# EAGLE design stm32f4 disc (EAGLE 7.7.0)
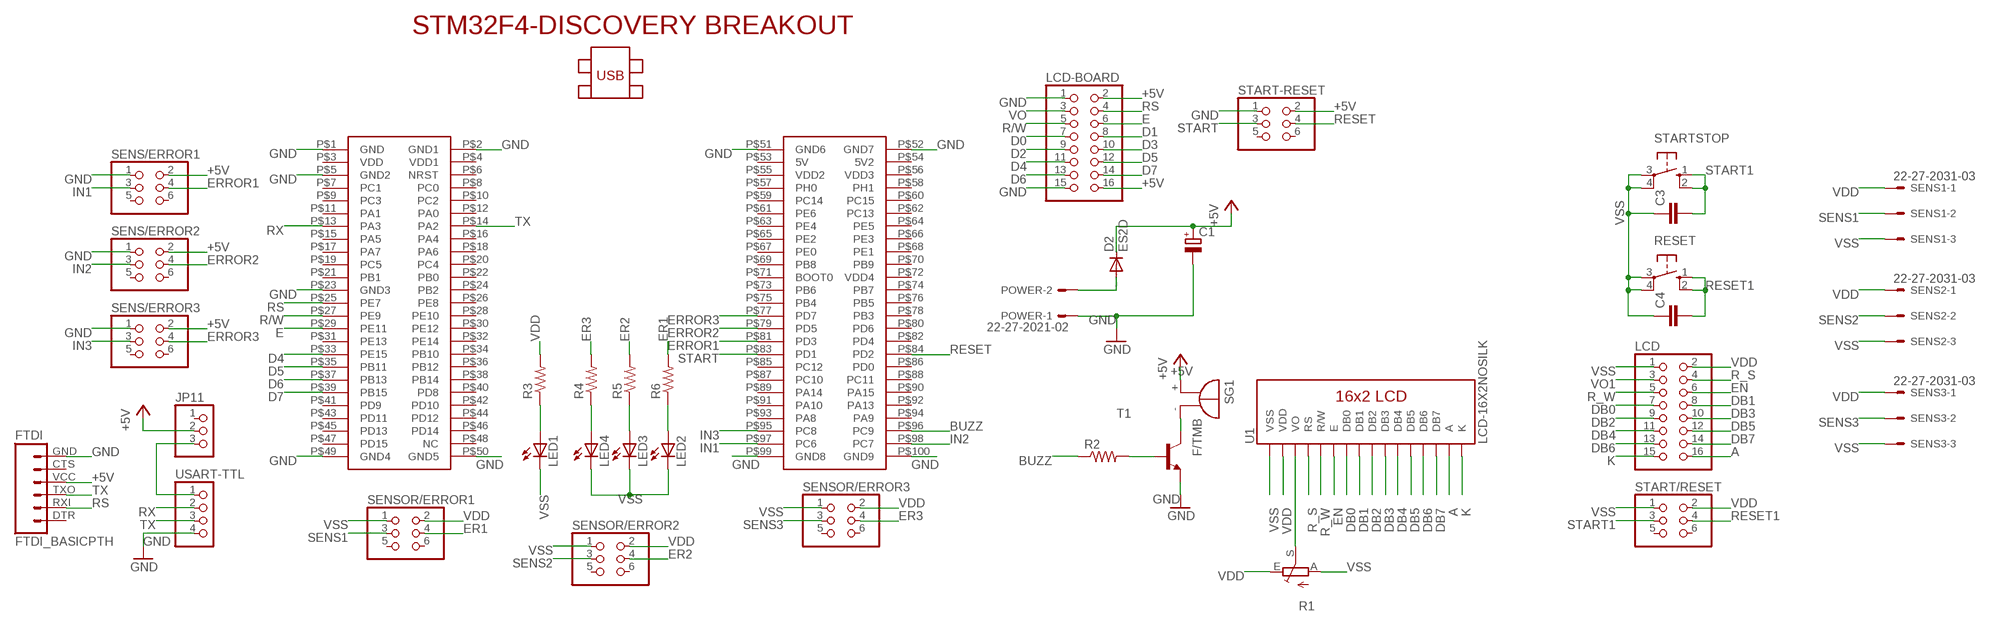
[diagram p0: schematic, sheet 1]

## Parts
C1  CPOL-EU140CLH-1010  [140CLH-1010]
C3  C-EUC0805  [C0805]
C4  C-EUC0805  [C0805]
D2  ES2D  [SMB]
FTDI  FTDI_BASICPTH  [FTDI_BASIC]
JP11  PINHD-1X3  [1X03]
LCD  PINHD-2X8  [2X08]
LCD-BOARD  PINHD-2X8  [2X08]
LED1  LED5MM  [LED5MM]
LED2  LED5MM  [LED5MM]
LED3  LED5MM  [LED5MM]
LED4  LED5MM  [LED5MM]
POWER  22-27-2021-02  [6410-02]
R1  TRIM_EU-CA6V  [CA6V]
R2  R-US_R0805  [R0805]
R3  R-US_R0805  [R0805]
R4  R-US_R0805  [R0805]
R5  R-US_R0805  [R0805]
R6  R-US_R0805  [R0805]
RESET  40-XX  [B3F-40XX]
SENS1  22-27-2031-03  [6410-03]
SENS2  22-27-2031-03  [6410-03]
SENS3  22-27-2031-03  [6410-03]
SENS/ERROR1  PINHD-2X3  [2X03]
SENS/ERROR2  PINHD-2X3  [2X03]
SENS/ERROR3  PINHD-2X3  [2X03]
SENSOR/ERROR1  PINHD-2X3  [2X03]
SENSOR/ERROR2  PINHD-2X3  [2X03]
SENSOR/ERROR3  PINHD-2X3  [2X03]
SG1  F/TMB  [F/TMB]
START-RESET  PINHD-2X3  [2X03]
START/RESET  PINHD-2X3  [2X03]
STARTSTOP  40-XX  [B3F-40XX]
T1  -NPN-SOT23-EBC  [SOT23-EBC]
U1  LCD-16X2NOSILK  [LCD-16X2_NOSILK]
U$1  STM32F4-DISCOVERY  [STM32F4-DISCOVERY]
USART-TTL  PINHD-1X4  [1X04]

## Nets
+5V: C1.+ D2.C FTDI.VCC JP11.2 LCD-BOARD.2 LCD-BOARD.16 SENS/ERROR1.2 SENS/ERROR2.2 SENS/ERROR3.2 SG1.+ START-RESET.2
A: LCD.16 U1.15(A)
BUZZ: R2.1 U$1.P$96(PC9)
D0: LCD-BOARD.7
D1: LCD-BOARD.8
D2: LCD-BOARD.9
D3: LCD-BOARD.10
D4: LCD-BOARD.11 U$1.P$33(PE15)
D5: LCD-BOARD.12 U$1.P$35(PB11)
D6: LCD-BOARD.13 U$1.P$37(PB13)
D7: LCD-BOARD.14 U$1.P$39(PB15)
DB0: LCD.7 U1.7(DB0)
DB1: LCD.8 U1.8(DB1)
DB2: LCD.9 U1.9(DB2)
DB3: LCD.10 U1.10(DB3)
DB4: LCD.11 U1.11(DB4)
DB5: LCD.12 U1.12(DB5)
DB6: LCD.13 U1.13(DB6)
DB7: LCD.14 U1.14(DB7)
E: LCD-BOARD.6 U$1.P$29(PE11)
EN: LCD.6 U1.6(E)
ER1: R6.2 SENSOR/ERROR1.4
ER2: R5.2 SENSOR/ERROR2.4
ER3: R4.2 SENSOR/ERROR3.4
ERROR1: SENS/ERROR1.4 U$1.P$81(PD3)
ERROR2: SENS/ERROR2.4 U$1.P$79(PD5)
ERROR3: SENS/ERROR3.4 U$1.P$77(PD7)
GND: C1.- FTDI.GND LCD-BOARD.1 LCD-BOARD.15 POWER.1 SENS/ERROR1.1 SENS/ERROR2.1 SENS/ERROR3.1 START-RESET.1 T1.E U$1.P$1(GND) U$1.P$2(GND1) U$1.P$5(GND2) U$1.P$23(GND3) U$1.P$49(GND4) U$1.P$50(GND5) U$1.P$51(GND6) U$1.P$52(GND7) U$1.P$99(GND8) U$1.P$100(GND9) USART-TTL.4
IN1: SENS/ERROR1.3 U$1.P$97(PC6)
IN2: SENS/ERROR2.3 U$1.P$98(PC7)
IN3: SENS/ERROR3.3 U$1.P$95(PC8)
K: LCD.15 U1.16(K)
N$1: SG1.- T1.C
N$2: R2.2 T1.B
N$7: LED2.A R6.1
N$8: LED3.A R5.1
N$9: JP11.3 USART-TTL.1
N$10: LED4.A R4.1
N$11: LED1.A R3.1
N$18: D2.A POWER.2
N$138: R1.S U1.3(VO)
R/W: LCD-BOARD.5 U$1.P$27(PE9)
R_S: LCD.4 U1.4(RS)
R_W: LCD.5 U1.5(R/W)
RESET: START-RESET.4 U$1.P$84(PD2)
RESET1: C4.2 RESET.1(S) RESET.2(S1) START/RESET.4
RS: FTDI.RXI LCD-BOARD.4 U$1.P$25(PE7)
RX: U$1.P$13(PA3) USART-TTL.2
SENS1: SENS1.2 SENSOR/ERROR1.3
SENS2: SENS2.2 SENSOR/ERROR2.3
SENS3: SENS3.2 SENSOR/ERROR3.3
START: START-RESET.3 U$1.P$83(PD1)
START1: C3.2 START/RESET.3 STARTSTOP.1(S) STARTSTOP.2(S1)
TX: FTDI.TXO U$1.P$14(PA2) USART-TTL.3
VDD: LCD.2 R1.E R3.2 SENS1.1 SENS2.1 SENS3.1 SENSOR/ERROR1.2 SENSOR/ERROR2.2 SENSOR/ERROR3.2 START/RESET.2 U1.2(VDD)
VO: LCD-BOARD.3
VO1: LCD.3
VSS: C3.1 C4.1 LCD.1 LED1.K(C) LED2.K(C) LED3.K(C) LED4.K(C) R1.A RESET.3(P) RESET.4(P1) SENS1.3 SENS2.3 SENS3.3 SENSOR/ERROR1.1 SENSOR/ERROR2.1 SENSOR/ERROR3.1 START/RESET.1 STARTSTOP.3(P) STARTSTOP.4(P1) U1.1(VSS)
Unconnected: FTDI.CTS FTDI.DTR JP11.1 SENS/ERROR1.5 SENS/ERROR1.6 SENS/ERROR2.5 SENS/ERROR2.6 SENS/ERROR3.5 SENS/ERROR3.6 SENSOR/ERROR1.5 SENSOR/ERROR1.6 SENSOR/ERROR2.5 SENSOR/ERROR2.6 SENSOR/ERROR3.5 SENSOR/ERROR3.6 START-RESET.5 START-RESET.6 START/RESET.5 START/RESET.6 U$1.P$3(VDD) U$1.P$4(VDD1) U$1.P$6(NRST) U$1.P$7(PC1) U$1.P$8(PC0) U$1.P$9(PC3) U$1.P$10(PC2) U$1.P$11(PA1) U$1.P$12(PA0) U$1.P$15(PA5) U$1.P$16(PA4) U$1.P$17(PA7) U$1.P$18(PA6) U$1.P$19(PC5) U$1.P$20(PC4) U$1.P$21(PB1) U$1.P$22(PB0) U$1.P$24(PB2) U$1.P$26(PE8) U$1.P$28(PE10) U$1.P$30(PE12) U$1.P$31(PE13) U$1.P$32(PE14) U$1.P$34(PB10) U$1.P$36(PB12) U$1.P$38(PB14) U$1.P$40(PD8) U$1.P$41(PD9) U$1.P$42(PD10) U$1.P$43(PD11) U$1.P$44(PD12) U$1.P$45(PD13) U$1.P$46(PD14) U$1.P$47(PD15) U$1.P$48(NC) U$1.P$53(5V) U$1.P$54(5V2) U$1.P$55(VDD2) U$1.P$56(VDD3) U$1.P$57(PH0) U$1.P$58(PH1) U$1.P$59(PC14) U$1.P$60(PC15) U$1.P$61(PE6) U$1.P$62(PC13) U$1.P$63(PE4) U$1.P$64(PE5) U$1.P$65(PE2) U$1.P$66(PE3) U$1.P$67(PE0) U$1.P$68(PE1) U$1.P$69(PB8) U$1.P$70(PB9) U$1.P$71(BOOT0) U$1.P$72(VDD4) U$1.P$73(PB6) U$1.P$74(PB7) U$1.P$75(PB4) U$1.P$76(PB5) U$1.P$78(PB3) U$1.P$80(PD6) U$1.P$82(PD4) U$1.P$85(PC12) U$1.P$86(PD0) U$1.P$87(PC10) U$1.P$88(PC11) U$1.P$89(PA14) U$1.P$90(PA15) U$1.P$91(PA10) U$1.P$92(PA13) U$1.P$93(PA8) U$1.P$94(PA9)

## Library data of the parts
C1 = rcl:CPOL-EU: POLARIZED CAPACITOR, European symbol
C3 C4 = rcl:C-EU: CAPACITOR, European symbol
D2 = diode:ES2D: DIODE super fast rectifier, 2 A
FTDI = SparkFun-Connectors:FTDI_BASIC: FTDI Basic header with labels
JP11 = pinhead:PINHD-1X3: PIN HEADER
LCD LCD-BOARD = pinhead:PINHD-2X8: PIN HEADER
LED1-LED4 = led:LED: LED OSRAM: - CHIPLED LG R971, LG N971, LY N971, LG Q971, LY Q971, LO R971, LY R971 LH N974, LH R974 LS Q976, LO Q976, LY Q976 LO Q996 - Hyper CHIPLED LW Q18S LB Q993, LB Q99A, LB R99A - SideLED LS A670, LO A670, LY A670, LG A670, LP A670 LB A673, LV A673, LT A673, LW A673 LH A674 LY A675 LS A676, LA A676, LO A676, LY A676, LW A676 LS A679, LY A679, LG A679 - Hyper Micro SIDELED® LS Y876, LA Y876, LO Y876, LY Y876 LT Y87S - SmartLED LW L88C, LW L88S LB L89C, LB L89S, LG L890 LS L89K, LO L89K, LY L89K LS L896, LA L896, LO L896, LY L896 - TOPLED LS T670, LO T670, LY T670, LG T670, LP T670 LSG T670, LSP T670, LSY T670, LOP T670, LYG T670 LG T671, LOG T671, LSG T671 LB T673, LV T673, LT T673, LW T673 LH T674 LS T676, LA T676, LO T676, LY T676, LB T676, LH T676, LSB T676, LW T676 LB T67C, LV T67C, LT T67C, LS T67K, LO T67K, LY T67K, LW E67C LS E67B, LA E67B, LO E67B, LY E67B, LB E67C, LV E67C, LT E67C LW T67C LS T679, LY T679, LG T679 LS T770, LO T770, LY T770, LG T770, LP T770 LB T773, LV T773, LT T773, LW T773 LH T774 LS E675, LA E675, LY E675, LS T675 LS T776, LA T776, LO T776, LY T776, LB T776 LHGB T686 LT T68C, LB T68C - Hyper Mini TOPLED® LB M676 - Mini TOPLED Santana® LG M470 LS M47K, LO M47K, LY M47K Source: http://www.osram.convergy.de LUXEON: - LUMILED® LXK2-PW12-R00, LXK2-PW12-S00, LXK2-PW14-U00, LXK2-PW14-V00 LXK2-PM12-R00, LXK2-PM12-S00, LXK2-PM14-U00 LXK2-PE12-Q00, LXK2-PE12-R00, LXK2-PE12-S00, LXK2-PE14-T00, LXK2-PE14-U00 LXK2-PB12-K00, LXK2-PB12-L00, LXK2-PB12-M00, LXK2-PB14-N00, LXK2-PB14-P00, LXK2-PB14-Q00 LXK2-PR12-L00, LXK2-PR12-M00, LXK2-PR14-Q00, LXK2-PR14-R00 LXK2-PD12-Q00, LXK2-PD12-R00, LXK2-PD12-S00 LXK2-PH12-R00, LXK2-PH12-S00 LXK2-PL12-P00, LXK2-PL12-Q00, LXK2-PL12-R00 Source: www.luxeon.com KINGBRIGHT: KA-3528ASYC Source: www.kingbright.com
POWER = con-molex:22-?-02: CONNECTOR wire to board 2.54 mm (.1 inch) pitch header; OC_FARNELL: unknown; OC_NEWARK: unknown
R1 = pot:TRIM_EU-: POTENTIOMETER
R2-R6 = rcl:R-US_: RESISTOR, American symbol
RESET STARTSTOP = switch-omron:40-XX: OMRON SWITCH; MF: OMRON COMPONENTS USA; MPN: B3F-4000; OC_FARNELL: 176434; OC_NEWARK: 36K3105
SENS1-SENS3 = con-molex:22-?-03: CONNECTOR wire to board 2.54 mm (.1 inch) pitch header; OC_FARNELL: unknown; OC_NEWARK: unknown
SENS/ERROR1-SENS/ERROR3 SENSOR/ERROR1-SENSOR/ERROR3 START-RESET START/RESET = pinhead:PINHD-2X3: PIN HEADER
SG1 = buzzer:F/TMB: BUZZER Source: Buerklin; OC_FARNELL: unknown; OC_NEWARK: unknown
T1 = transistor-neu-to92:*-NPN-: NPN Transistror
U1 = SparkFun-Displays:LCD-16X2: Standard text-only 16x2 parallel input LCD
U$1 = STM32F4-DISCOVERY 2:STM32F4-DISCOVERY
USART-TTL = pinhead:PINHD-1X4: PIN HEADER

## Board
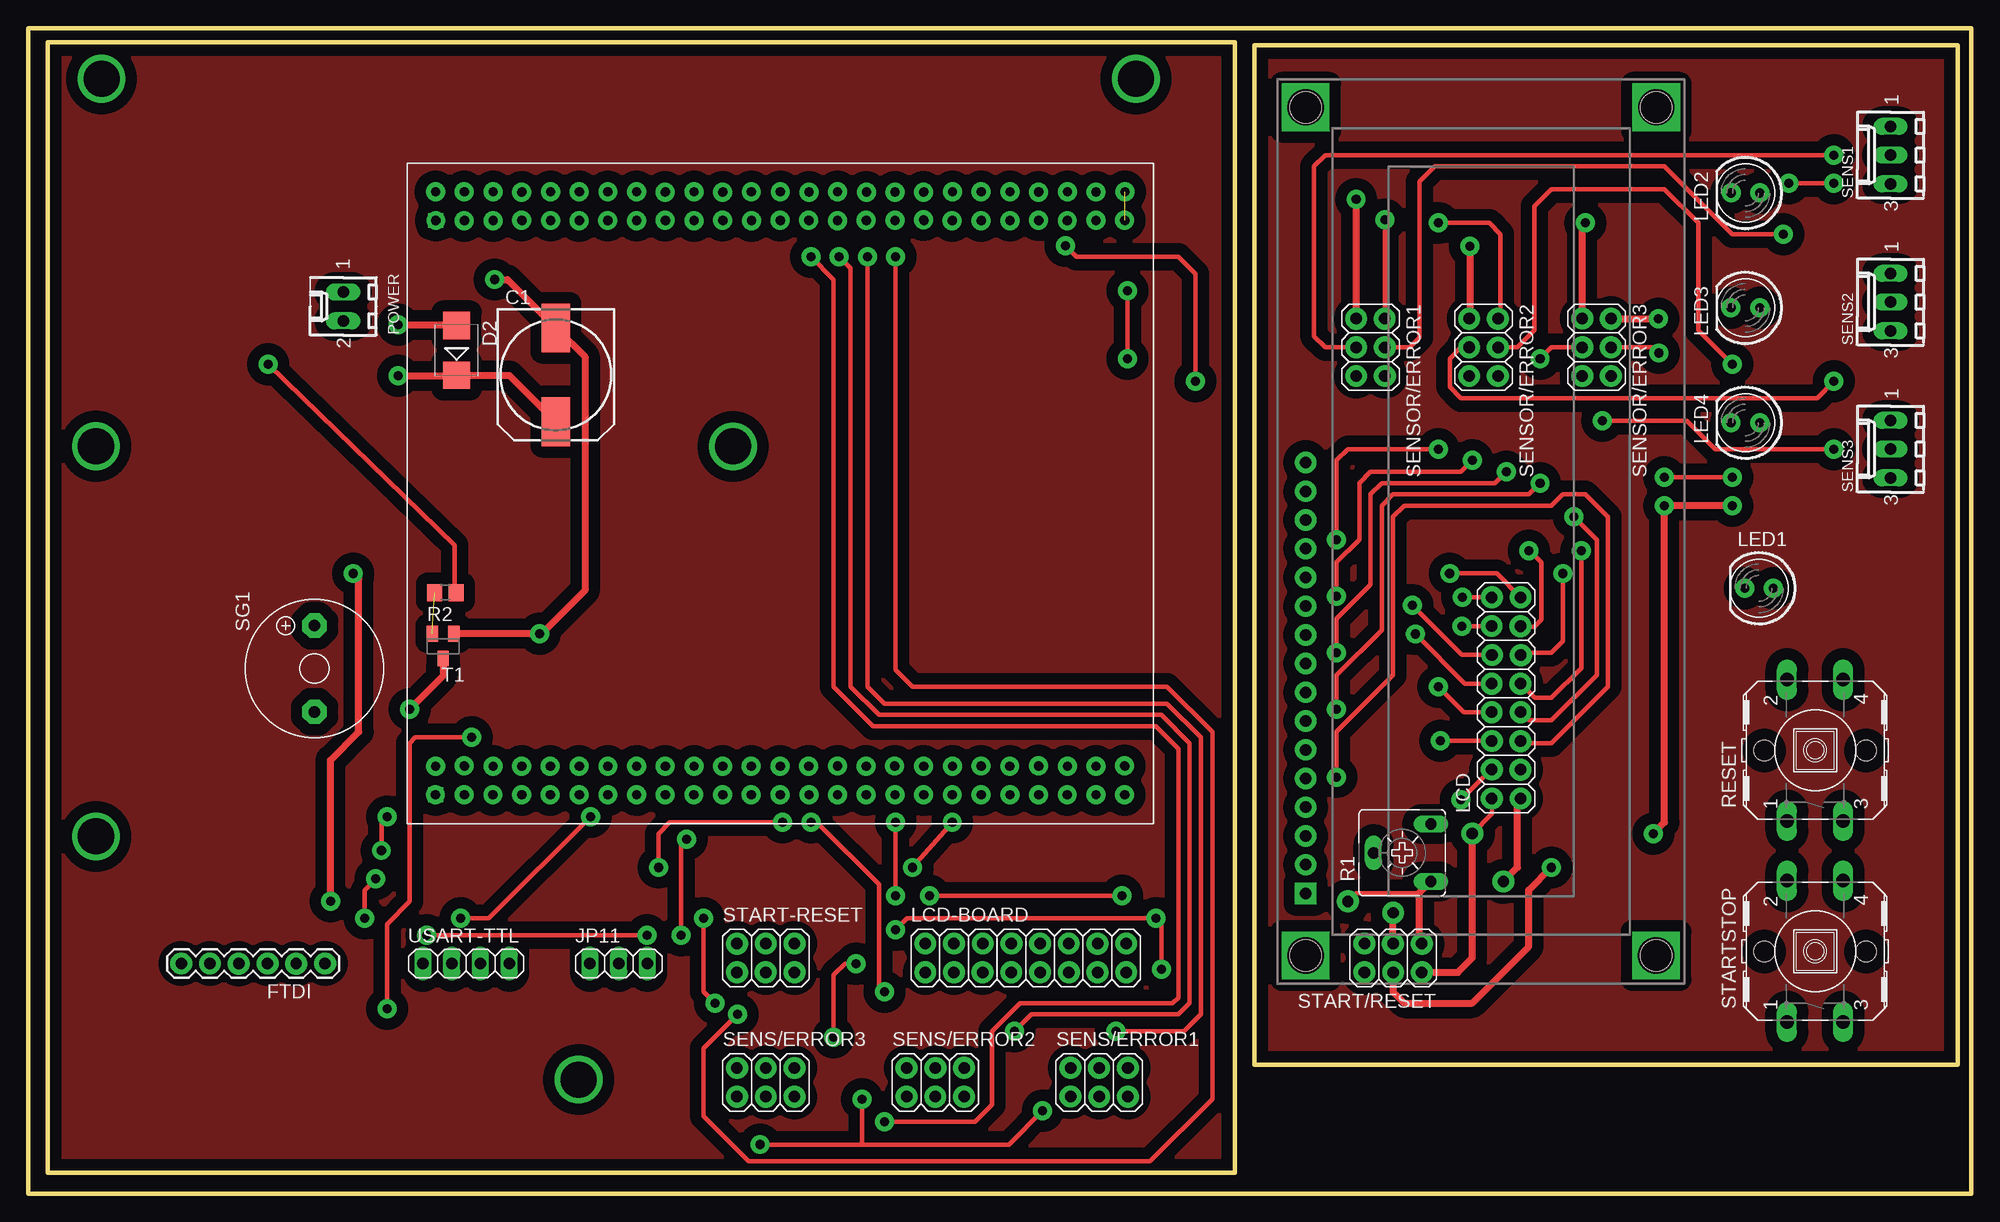
[diagram p1: board, top side]
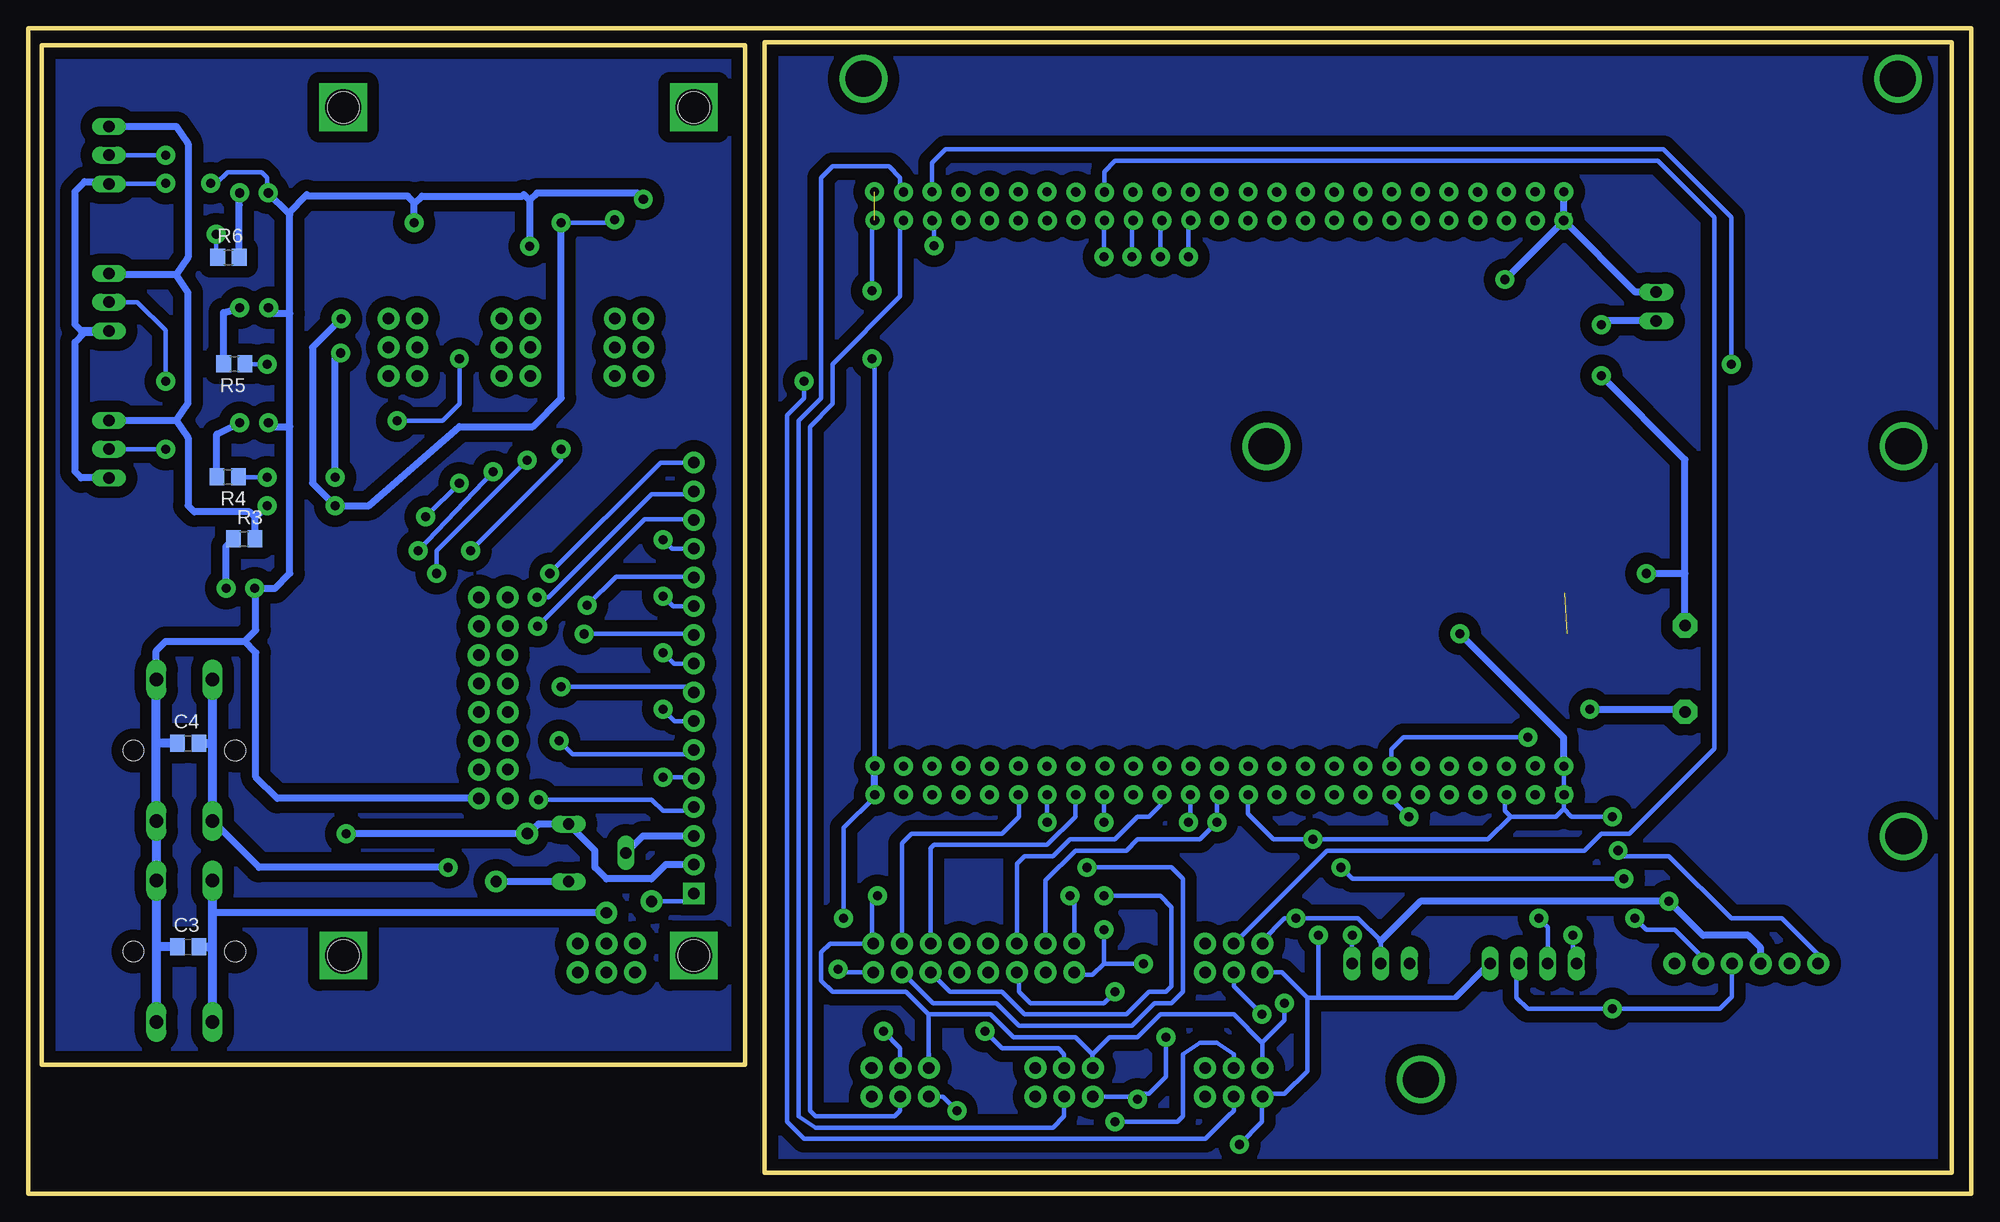
[diagram p2: board, bottom side, seen from below]

Size 171.88 x 103.06 mm. Coordinates in mm from the lower left corner, seen from the top.
Outline: 0,0 171.88,0 171.88,103.06 0,103.06 0,0
Outline: 108.47,11.39 108.47,101.56 170.7,101.56 170.7,11.39 108.47,11.39
Outline: 1.74,101.84 106.74,101.84 106.74,1.84 1.74,1.84 1.74,101.84
Copper layers (1*16): Top 0.035mm / dielectric 1.5mm / Bottom 0.035mm
Design rules "default": minimum track width 10mil, minimum drill 24mil, track to track 8mil, track to pad 8mil, pad to pad 8mil, via to via 8mil, smd to smd 8mil, copper to edge 40mil, drill to drill 8mil, minimum pad ring 10mil, minimum via ring 8mil, stop-mask expansion 4mil, vias tented up to drill 0mil, thermal gap 10mil

### Footprints (pad centres in the part's own frame; a part is rotated, then mirrored left to right if it is on the bottom)
140CLH-1010 = smd 4.3 x 2.5: + 4.15,0; - -4.15,0
C0805 = smd 1.3 x 1.5: 1 -0.95,0; 2 0.95,0
SMB = smd 2.4 x 2.4: A 2.2,0; C -2.2,0
FTDI_BASIC = drill 1.016 pad 1.88: CTS 10.16,0; DTR 0,0; GND 12.7,0; RXI 2.54,0; TXO 5.08,0; VCC 7.62,0
1X03 = drill 1.016 long: 1 -2.54,0; 2 0,0; 3 2.54,0
2X08 = drill 1.016 octagon: 1 -8.89,-1.27; 2 -8.89,1.27; 3 -6.35,-1.27; 4 -6.35,1.27; 5 -3.81,-1.27; 6 -3.81,1.27; 7 -1.27,-1.27; 8 -1.27,1.27; 9 1.27,-1.27; 10 1.27,1.27; 11 3.81,-1.27; 12 3.81,1.27; 13 6.35,-1.27; 14 6.35,1.27; 15 8.89,-1.27; 16 8.89,1.27
LED5MM = drill 0.813 octagon: A -1.27,0; K 1.27,0
6410-02 = drill 1.016 long: 1 1.27,0; 2 -1.27,0
CA6V = drill 1.016 long: A -2.54,-2.54; E 2.54,-2.54; S 0,2.54
R0805 = smd 1.3 x 1.5: 1 -0.95,0; 2 0.95,0
B3F-40XX = drill 1.194 long: 1 -6.248,2.489; 2 6.248,2.489; 3 -6.248,-2.489; 4 6.248,-2.489 | hole 1.803: 0,-4.496; 0,4.496
6410-03 = drill 1.016 long: 1 2.54,0; 2 0,0; 3 -2.54,0
2X03 = drill 1.016 octagon: 1 -2.54,-1.27; 2 -2.54,1.27; 3 0,-1.27; 4 0,1.27; 5 2.54,-1.27; 6 2.54,1.27
F/TMB = drill 1.016 pad 2.159 octagon: + 3.81,0; - -3.81,0
SOT23-EBC = smd 1 x 1.4: B 0.95,-1.1; C 0,1.1; E -0.95,-1.1
LCD-16X2_NOSILK = drill 1.016 pad 1.88 square: 1 -32,15.5 | drill 1.016 pad 1.88: 2 -29.46,15.5; 3 -26.92,15.5; 4 -24.38,15.5; 5 -21.84,15.5; 6 -19.3,15.5; 7 -16.76,15.5; 8 -14.22,15.5; 9 -11.68,15.5; 10 -9.14,15.5; 11 -6.6,15.5; 12 -4.06,15.5; 13 -1.52,15.5; 14 1.02,15.5; 15 3.56,15.5; 16 6.1,15.5 | hole 2.8: -37.5,15.5; -37.5,-15.5; 37.5,15.5; 37.5,-15.5
STM32F4-DISCOVERY = drill 0.8 square: P$1 -27.94,30.48; P$51 22.86,30.48 | drill 0.8: P$2 -25.4,30.48; P$3 -27.94,27.94; P$4 -25.4,27.94; P$5 -27.94,25.4; P$6 -25.4,25.4; P$7 -27.94,22.86; P$8 -25.4,22.86; P$9 -27.94,20.32; P$10 -25.4,20.32; P$11 -27.94,17.78; P$12 -25.4,17.78; P$13 -27.94,15.24; P$14 -25.4,15.24; P$15 -27.94,12.7; P$16 -25.4,12.7; P$17 -27.94,10.16; P$18 -25.4,10.16; P$19 -27.94,7.62; P$20 -25.4,7.62; P$21 -27.94,5.08; P$22 -25.4,5.08; P$23 -27.94,2.54; P$24 -25.4,2.54; P$25 -27.94,0; P$26 -25.4,0; P$27 -27.94,-2.54; P$28 -25.4,-2.54; P$29 -27.94,-5.08; P$30 -25.4,-5.08; P$31 -27.94,-7.62; P$32 -25.4,-7.62; P$33 -27.94,-10.16; P$34 -25.4,-10.16; P$35 -27.94,-12.7; P$36 -25.4,-12.7; P$37 -27.94,-15.24; P$38 -25.4,-15.24; P$39 -27.94,-17.78; P$40 -25.4,-17.78; P$41 -27.94,-20.32; P$42 -25.4,-20.32; P$43 -27.94,-22.86; P$44 -25.4,-22.86; P$45 -27.94,-25.4; P$46 -25.4,-25.4; P$47 -27.94,-27.94; P$48 -25.4,-27.94; P$49 -27.94,-30.48; P$50 -25.4,-30.48; P$52 25.4,30.48; P$53 22.86,27.94; P$54 25.4,27.94; P$55 22.86,25.4; P$56 25.4,25.4; P$57 22.86,22.86; P$58 25.4,22.86; P$59 22.86,20.32; P$60 25.4,20.32; P$61 22.86,17.78; P$62 25.4,17.78; P$63 22.86,15.24; P$64 25.4,15.24; P$65 22.86,12.7; P$66 25.4,12.7; P$67 22.86,10.16; P$68 25.4,10.16; P$69 22.86,7.62; P$70 25.4,7.62; P$71 22.86,5.08; P$72 25.4,5.08; P$73 22.86,2.54; P$74 25.4,2.54; P$75 22.86,0; P$76 25.4,0; P$77 22.86,-2.54; P$78 25.4,-2.54; P$79 22.86,-5.08; P$80 25.4,-5.08; P$81 22.86,-7.62; P$82 25.4,-7.62; P$83 22.86,-10.16; P$84 25.4,-10.16; P$85 22.86,-12.7; P$86 25.4,-12.7; P$87 22.86,-15.24; P$88 25.4,-15.24; P$89 22.86,-17.78; P$90 25.4,-17.78; P$91 22.86,-20.32; P$92 25.4,-20.32; P$93 22.86,-22.86; P$94 25.4,-22.86; P$95 22.86,-25.4; P$96 25.4,-25.4; P$97 22.86,-27.94; P$98 25.4,-27.94; P$99 22.86,-30.48; P$100 25.4,-30.48
1X04 = drill 1.016 long: 1 -3.81,0; 2 -1.27,0; 3 1.27,0; 4 3.81,0

### Placement (x,y rotation side)
C1  46.67,72.41 270 top
C3  157.74,21.84 0 bottom
C4  157.74,39.84 0 bottom
D2  37.89,74.57 90 top
FTDI  26.24,20.34 180 top
JP11  52.24,20.34 0 top
LCD  130.74,43.84 90 top
LCD-BOARD  88.24,20.84 0 top
LED1  153.11,53.53 180 top
LED2  151.91,88.49 180 top
LED3  151.91,78.33 180 top
LED4  151.91,68.17 180 top
POWER  27.86,78.46 90 top
R1  121.54,30.14 90 top
R2  36.9,53.15 180 top
R3  152.77,57.9 0 bottom
R4  154.24,63.38 0 bottom
R5  153.65,73.38 0 bottom
R6  154.17,82.8 180 bottom
RESET  158.07,39.2 90 top
SENS1  164.74,91.84 90 top
SENS2  164.74,78.84 90 top
SENS3  164.74,65.84 90 top
SENS/ERROR1  94.74,9.84 0 top
SENS/ERROR2  80.24,9.84 0 top
SENS/ERROR3  65.24,9.84 0 top
SENSOR/ERROR1  118.74,74.84 270 top
SENSOR/ERROR2  128.74,74.84 270 top
SENSOR/ERROR3  138.74,74.84 270 top
SG1  25.32,46.42 90 top
START-RESET  65.24,20.84 0 top
START/RESET  120.74,20.84 180 top
STARTSTOP  158.07,21.42 90 top
T1  36.7,48.42 180 top
U1  128.51,58.55 90 top
U$1  66.53,63.2 90 top
USART-TTL  38.74,20.34 0 top

### Tracks (layer width: path | path; a pad name or v marks a point on that pad's centre or on a via)
+5V  (via drill 0.8 pad 1.68)
  Top 0.406: v60.74,16.84 59.74,17.84 v59.74,24.34 | v79.74,26.34 v96.74,26.34
  Top 0.61: C1.+ 42.56,72.37 D2.C 37.86,72.34 v32.74,72.34 | v26.74,25.84 26.74,38.34 29.24,40.84 29.24,54.34 v28.74,54.84
  Bottom 0.406: 92.24,12.34 92.24,11.65 SENS/ERROR1.2 92.2,12.38 92.24,12.42 92.24,15.84 | 77.74,12.34 79.24,13.84 84.74,13.84 86.74,15.84 92.24,15.84 | 77.74,12.34 77.74,11.65 SENS/ERROR2.2 | 92.24,15.84 94.24,17.84 100.74,17.84 101.74,18.84 101.74,21.34 100.97,22.11 LCD-BOARD.16 97.24,22.22 97.24,25.84 v96.74,26.34 | SENS/ERROR3.2 62.7,13.3 62.74,13.34 | 62.74,13.34 65.24,15.84 71.74,15.84 73.74,13.84 76.24,13.84 77.74,12.34 | START-RESET.2 62.7,22.38 60.74,24.34 v59.74,24.34 54.24,24.34 52.24,22.34 JP11.2 | v60.74,16.84 60.74,15.34 62.74,13.34 | LCD-BOARD.2 79.35,25.95 v79.74,26.34
  Bottom 0.61: SG1.+ 25.32,54.84 | 25.32,54.84 25.32,64.92 v32.74,72.34 | FTDI.VCC 18.62,21.72 19.74,22.84 23.74,22.84 v26.74,25.84 48.74,25.84 52.24,22.34 | v28.74,54.84 25.32,54.84
A  (via drill 0.8 pad 1.68)
  Top 0.406: LCD.16 v126.85,52.73
  Bottom 0.406: U1.15 113.28,61.84 116.74,61.84 125.85,52.73 v126.85,52.73
BUZZ  (via drill 0.8 pad 1.68)
  Top 0.406: v21.24,73.34 37.74,57.34 37.74,53.26 R2.1
  Bottom 0.406: U$1.P$96 91.93,91.15 90.74,92.34 27.24,92.34 21.24,86.34 v21.24,73.34
D4  (via drill 0.8 pad 1.68)
  Top 0.406: v76.74,26.34 v76.74,32.84
  Bottom 0.406: v76.74,32.84 76.74,35.21 U$1.P$33 | LCD-BOARD.11 90.32,17.84 85.74,17.84 83.74,15.84 74.74,15.84 72.74,17.84 71.24,17.84 70.74,18.34 70.74,25.34 71.74,26.34 v76.74,26.34
D5
  Bottom 0.406: LCD-BOARD.12 92.05,30.53 91.74,30.84 81.74,30.84 79.24,33.34 U$1.P$35
D6  (via drill 0.8 pad 1.68)
  Top 0.406: v78.24,28.84 v81.74,32.84
  Bottom 0.406: v81.74,32.84 81.74,35.23 U$1.P$37 | LCD-BOARD.13 91.86,16.84 86.24,16.84 84.24,14.84 74.24,14.84 72.24,16.84 70.74,16.84 69.74,17.84 69.74,27.84 70.74,28.84 v78.24,28.84
D7
  Bottom 0.406: LCD-BOARD.14 94.59,30.99 93.74,31.84 85.74,31.84 84.24,33.34 84.24,35.19 U$1.P$39
DB0  (via drill 0.8 pad 1.68)
  Top 0.406: v133.74,62.84 132.74,61.84 120.74,61.84 119.74,60.84 119.74,49.84 115.74,45.84 v115.74,42.84 | v136.74,59.84 138.74,57.84 138.74,45.84 134.74,41.84 132.74,41.84 LCD.7
  Bottom 0.406: v115.74,42.84 114.69,41.79 U1.7 | v133.74,62.84 v136.74,59.84
DB1  (via drill 0.8 pad 1.68)
  Top 0.406: LCD.8 127.01,42.57 v124.74,44.84
  Bottom 0.406: v124.74,44.84 113.52,44.84 U1.8
DB2  (via drill 0.8 pad 1.68)
  Top 0.406: v137.38,56.84 137.38,46.48 134.74,43.84 133.28,43.84 LCD.9 | v130.74,63.84 129.74,62.84 119.74,62.84 118.74,61.84 118.74,53.84 115.74,50.84 v115.74,47.84
  Bottom 0.406: v137.38,56.84 v130.74,63.84 | v115.74,47.84 114.77,46.87 U1.9
DB3  (via drill 0.8 pad 1.68)
  Top 0.406: LCD.10 127.09,45.11 v122.71,49.49
  Bottom 0.406: v122.71,49.49 113.09,49.49 U1.10
DB4  (via drill 0.8 pad 1.68)
  Top 0.406: v127.74,64.84 126.74,63.84 118.74,63.84 117.74,62.84 117.74,57.84 115.74,55.84 v115.74,52.84 | v135.74,54.84 135.74,48.84 134.74,47.84 132.2,47.84 LCD.11
  Bottom 0.406: v115.74,52.84 114.85,51.95 U1.11 | v135.74,54.84 135.74,56.84 v127.74,64.84
DB5  (via drill 0.8 pad 1.68)
  Top 0.406: LCD.12 126.82,47.65 v122.44,52.03
  Bottom 0.406: U1.12 113.09,54.57 119.9,54.57 v122.44,52.03
DB6  (via drill 0.8 pad 1.68)
  Top 0.406: v124.74,65.84 116.74,65.84 115.74,64.84 v115.74,57.84 | v132.74,56.84 132.87,56.84 133.87,55.84 133.87,50.76 133.24,50.12 132.08,50.12 LCD.13
  Bottom 0.406: v115.74,57.84 114.93,57.03 U1.13 | v124.74,65.84 124.74,64.84 v132.74,56.84
DB7  (via drill 0.8 pad 1.68)
  Top 0.406: LCD.14 v126.82,50.19
  Bottom 0.406: v126.82,50.19 117.36,59.65 113.09,59.65 U1.14
E
  Bottom 0.406: LCD-BOARD.6 84.43,29.15 83.74,29.84 81.24,29.84 79.74,31.34 75.74,31.34 73.74,33.34 72.74,33.34 71.74,34.34 71.74,35.13 U$1.P$29
EN  (via drill 0.8 pad 1.68)
  Top 0.406: LCD.6 v124.93,40.03
  Bottom 0.406: v124.93,40.03 123.74,38.84 113.42,38.84 U1.6
ER1  (via drill 0.8 pad 1.68)
  Top 0.406: SENSOR/ERROR1.4 122.24,74.84 123.08,75.67 123.08,89.5 124.42,90.84 144.74,90.84 150.74,84.84 v155.24,84.84
  Bottom 0.406: v155.24,84.84 155.24,82.42 R6.2
ER2  (via drill 0.8 pad 1.68)
  Top 0.406: SENSOR/ERROR2.4 131.74,74.84 133.24,76.34 133.24,87.34 134.74,88.84 144.74,88.84 147.74,85.84 147.74,76.34 v150.74,73.34
  Bottom 0.406: v150.74,73.34 152.66,73.34 R5.2
ER3  (via drill 0.8 pad 1.68)
  Top 0.406: SENSOR/ERROR3.4 143.74,74.84 v144.24,74.34 | v144.74,63.34 v150.74,63.34
  Bottom 0.406: v150.74,63.34 153.25,63.34 R4.2
  Bottom 0.61: v144.74,63.34 144.74,73.84 v144.24,74.34
ERROR1  (via drill 0.8 pad 1.68)
  Top 0.406: v96.24,14.34 102.24,14.34 103.74,15.84 103.74,40.34 100.74,43.34 75.74,43.34 74.24,44.84 v74.24,82.84
  Bottom 0.406: SENS/ERROR1.4 94.74,12.84 v96.24,14.34 | v74.24,82.84 74.24,85.97 U$1.P$81
ERROR2  (via drill 0.8 pad 1.68)
  Top 0.406: v87.24,14.34 88.74,15.84 101.74,15.84 102.74,16.84 102.74,39.84 100.24,42.34 75.24,42.34 72.74,44.84 72.74,81.84 v71.74,82.84
  Bottom 0.406: SENS/ERROR2.4 80.24,12.34 80.74,12.84 85.74,12.84 v87.24,14.34 | v71.74,82.84 71.74,85.93 U$1.P$79
ERROR3  (via drill 0.8 pad 1.68)
  Top 0.406: v69.24,82.84 71.24,80.84 71.24,44.84 74.74,41.34 99.74,41.34 101.74,39.34 101.74,17.34 101.24,16.84 87.74,16.84 85.24,14.34 85.24,7.84 83.74,6.34 v75.74,6.34
  Bottom 0.406: SENS/ERROR3.4 65.24,12.34 66.74,13.34 68.24,13.34 69.74,12.34 69.74,6.84 70.24,6.34 v75.74,6.34 | v69.24,82.84 69.24,85.89 U$1.P$77
GND  (via drill 0.8 pad 1.68)  (1 unrouted)
  Top 0.406: v89.74,7.34 86.74,4.34 73.74,4.34 | 73.74,4.34 v64.74,4.34 | v73.74,8.34 73.74,4.34 | v31.24,30.34 31.24,32.84 v31.74,33.34 | v100.24,19.84 100.24,23.84 v99.74,24.34 77.74,24.34 v76.74,23.34 | v97.24,73.84 v97.24,79.84 | v71.24,13.84 71.24,19.34 72.24,20.34 v73.24,20.34 | v57.74,22.84 57.74,30.84 v58.24,31.34
  Top 0.61: v41.24,80.84 42.39,80.84 C1.- 49.24,73.99 49.24,53.34 45.42,49.52 v45.24,49.52 T1.E
  Bottom 0.406: SENS/ERROR1.1 90.97,8.57 v89.74,7.34 | v64.74,4.34 62.74,6.34 62.74,8.53 SENS/ERROR3.1 62.43,8.84 60.74,8.84 58.74,10.84 58.74,17.34 | v73.74,8.34 73.97,8.57 SENS/ERROR2.1 74.01,8.57 73.74,8.84 72.74,8.84 71.24,10.34 v71.24,13.84 | START-RESET.1 60.97,19.57 58.74,17.34 | U$1.P$2 U$1.P$1 36.05,34.03 | 36.05,34.03 36.74,33.34 40.74,33.34 | 40.74,33.34 41.24,33.84 41.24,35.15 U$1.P$5 | 58.74,17.34 57.74,17.34 | 45.74,17.34 45.55,17.34 USART-TTL.4 42.74,20.34 45.74,17.34 | FTDI.GND 13.54,21.14 16.74,24.34 21.24,24.34 26.74,29.84 30.74,29.84 v31.24,30.34 | v31.74,33.34 35.36,33.34 36.05,34.03 | U$1.P$23 63.99,33.59 61.74,31.34 60.24,31.34 v58.24,31.34 42.74,31.34 40.74,33.34 | LCD-BOARD.15 99.97,19.57 v100.24,19.84 | v76.74,23.34 76.74,20.34 | 76.74,20.34 77.74,19.34 79.12,19.34 LCD-BOARD.1 | U$1.P$49 97.01,35.07 99.74,32.34 v99.74,24.34 | U$1.P$50 97.01,73.61 v97.24,73.84 | v97.24,79.84 97.24,85.83 U$1.P$99 | v73.24,20.34 76.74,20.34 | 45.74,17.34 57.74,17.34 | 57.74,17.34 v57.74,22.84
  Bottom 0.61: POWER.1 29.72,79.73 U$1.P$51 | U$1.P$51 U$1.P$52 | U$1.P$51 36.05,86.03 v41.24,80.84 | U$1.P$49 U$1.P$50 | U$1.P$2 36.05,40.33 v45.24,49.52
IN1
  Bottom 0.406: SENS/ERROR1.3 94.74,7.34 95.24,6.84 102.24,6.84 102.74,7.34 102.74,67.84 100.74,69.84 100.74,73.34 94.74,79.34 94.74,85.79 U$1.P$97
IN2
  Bottom 0.406: SENS/ERROR2.3 80.24,6.84 81.24,5.84 102.24,5.84 103.74,6.84 103.74,68.34 101.74,70.34 101.74,89.84 100.74,90.84 95.74,90.84 94.74,89.84 94.74,88.87 U$1.P$98
IN3  (via drill 0.8 pad 1.68)
  Top 0.406: v103.24,71.84 103.24,81.34 101.74,82.84 92.74,82.84 v91.74,83.84
  Bottom 0.406: SENS/ERROR3.3 65.24,7.34 65.74,6.84 66.24,6.34 67.74,4.84 103.24,4.84 104.74,6.34 104.74,68.84 103.24,70.34 v103.24,71.84 | v91.74,83.84 91.74,85.87 U$1.P$95
K  (via drill 0.8 pad 1.68)
  Top 0.406: v125.74,54.84 129.9,54.84 LCD.15
  Bottom 0.406: U1.16 115.93,64.65 v125.74,54.84
N$1  (via drill 0.8 pad 1.68)
  Top 0.61: T1.C 36.7,45.8 v33.74,42.84
  Bottom 0.61: v33.74,42.84 25.55,42.84 SG1.-
N$2  (1 unrouted)
N$3  (via drill 3.2 pad 1.78)
  other vias: 97.99,98.59
N$4  (via drill 3.2 pad 1.78)
  other vias: 5.99,31.59
N$5  (via drill 3.2 pad 1.78)
  other vias: 6.49,98.59
N$6  (via drill 3.2)
  other vias: 113,21.05
N$7
  Bottom 0.61: R6.1 153.22,87.45 LED2.A
N$8
  Bottom 0.61: R5.1 154.6,77.91 LED3.A
N$9  (via drill 0.8 pad 1.68)
  Top 0.406: v54.74,22.84 v35.24,22.84
  Bottom 0.406: JP11.3 54.78,22.3 v54.74,22.84 | v35.24,22.84 35.24,20.65 USART-TTL.1
N$10
  Bottom 0.61: R4.1 155.19,67.16 LED4.A
N$11
  Bottom 0.61: LED1.A 154.38,57.24 R3.1
N$12  (via drill 3.2 pad 1.78)
  other vias: 5.99,66.09
N$13  (via drill 0.8 pad 1.68)
  other vias: 36.06,86.06
N$14  (via drill 0.8 pad 1.68)
  other vias: 36.04,88.59
N$15  (via drill 0.8 pad 1.68)
  other vias: 41.11,88.6
N$16  (via drill 0.8 pad 1.68)
  other vias: 43.66,86.1
N$17  (via drill 0.8 pad 1.68)
  other vias: 48.72,88.59
N$18  (via drill 0.8 pad 1.68)
  Top 0.61: v32.74,76.84 37.82,76.84 D2.A
  Bottom 0.61: POWER.2 32.39,77.19 v32.74,76.84
N$19  (via drill 0.8 pad 1.68)
  other vias: 43.65,88.56
N$20  (via drill 3.2)
  other vias: 113,96.08
N$21  (via drill 3.2)
  other vias: 144.02,96.07
N$22  (via drill 0.8 pad 1.68)
  other vias: 38.58,88.59
N$23  (via drill 0.8 pad 1.68)
  other vias: 38.57,86.05
N$24  (via drill 0.8 pad 1.68)
  other vias: 41.12,86.05
N$25  (via drill 0.8 pad 1.68)
  other vias: 46.2,88.59
N$26  (via drill 0.8 pad 1.68)
  other vias: 46.19,86.06
N$27  (via drill 0.8 pad 1.68)
  other vias: 51.27,88.59
N$28  (via drill 0.8 pad 1.68)
  other vias: 48.74,86.05
N$29  (via drill 0.8 pad 1.68)
  other vias: 51.26,86.06
N$30  (via drill 0.8 pad 1.68)
  other vias: 53.81,88.59
N$31  (via drill 0.8 pad 1.68)
  other vias: 53.81,86.06
N$32  (via drill 0.8 pad 1.68)
  other vias: 56.34,88.56
N$33  (via drill 0.8 pad 1.68)
  other vias: 56.35,86.1
N$34  (via drill 0.8 pad 1.68)
  other vias: 58.89,88.6
N$35  (via drill 0.8 pad 1.68)
  other vias: 58.89,86.05
N$36  (via drill 0.8 pad 1.68)
  other vias: 61.42,86.1
N$37  (via drill 0.8 pad 1.68)
  other vias: 61.44,88.56
N$38  (via drill 0.8 pad 1.68)
  other vias: 63.96,88.6
N$39  (via drill 0.8 pad 1.68)
  other vias: 63.98,86.05
N$40  (via drill 0.8 pad 1.68)
  other vias: 66.51,86.06
N$41  (via drill 0.8 pad 1.68)
  other vias: 66.53,88.6
N$42  (via drill 0.8 pad 1.68)
  other vias: 69.04,86.1
N$43  (via drill 0.8 pad 1.68)
  other vias: 69.05,88.56
N$44  (via drill 0.8 pad 1.68)
  other vias: 71.6,86.05
N$45  (via drill 0.8 pad 1.68)
  other vias: 71.6,88.6
N$46  (via drill 0.8 pad 1.68)
  other vias: 74.12,86.1
N$47  (via drill 0.8 pad 1.68)
  other vias: 74.14,88.57
N$48  (via drill 0.8 pad 1.68)
  other vias: 76.68,88.57
N$49  (via drill 0.8 pad 1.68)
  other vias: 76.68,86.1
N$50  (via drill 0.8 pad 1.68)
  other vias: 79.22,86.11
N$51  (via drill 0.8 pad 1.68)
  other vias: 79.22,88.55
N$52  (via drill 0.8 pad 1.68)
  other vias: 81.74,86.05
N$53  (via drill 0.8 pad 1.68)
  other vias: 84.29,86.05
N$54  (via drill 0.8 pad 1.68)
  other vias: 81.76,88.61
N$55  (via drill 0.8 pad 1.68)
  other vias: 84.3,88.6
N$56  (via drill 0.8 pad 1.68)
  other vias: 86.83,88.59
N$57  (via drill 0.8 pad 1.68)
  other vias: 86.84,86.06
N$58  (via drill 0.8 pad 1.68)
  other vias: 89.36,88.57
N$59  (via drill 0.8 pad 1.68)
  other vias: 89.36,86.1
N$60  (via drill 0.8 pad 1.68)
  other vias: 91.91,88.61
N$61  (via drill 0.8 pad 1.68)
  other vias: 91.91,86.05
N$62  (via drill 0.8 pad 1.68)
  other vias: 94.44,88.58
N$63  (via drill 0.8 pad 1.68)
  other vias: 94.44,86.1
N$64  (via drill 0.8 pad 1.68)
  other vias: 97,88.59
N$65  (via drill 0.8 pad 1.68)
  other vias: 96.99,86.07
N$66  (via drill 0.8 pad 1.68)
  other vias: 154.36,53.53
N$67  (via drill 0.8 pad 1.68)
  other vias: 151.84,53.53
N$68  (via drill 0.8 pad 1.68)
  other vias: 150.63,68.17
N$69  (via drill 0.8 pad 1.68)
  other vias: 153.18,68.17
N$70  (via drill 0.8 pad 1.68)
  other vias: 150.63,78.34
N$71  (via drill 0.8 pad 1.68)
  other vias: 153.18,78.33
N$72  (via drill 0.8 pad 1.68)
  other vias: 150.65,88.5
N$73  (via drill 0.8 pad 1.68)
  other vias: 153.17,88.5
N$74  (via drill 0.8 pad 1.68)
  other vias: 36.02,37.81
N$75  (via drill 0.8 pad 1.68)
  other vias: 38.56,37.82
N$76  (via drill 0.8 pad 1.68)
  other vias: 36.02,35.27
N$77  (via drill 0.8 pad 1.68)
  other vias: 38.55,35.28
N$78  (via drill 0.8 pad 1.68)
  other vias: 41.1,35.27
N$79  (via drill 0.8 pad 1.68)
  other vias: 41.1,37.81
N$80  (via drill 0.8 pad 1.68)
  other vias: 43.65,37.81
N$81  (via drill 0.8 pad 1.68)
  other vias: 43.64,35.26
N$82  (via drill 0.8 pad 1.68)
  other vias: 46.17,35.27
N$83  (via drill 0.8 pad 1.68)
  other vias: 46.18,37.81
N$84  (via drill 0.8 pad 1.68)
  other vias: 48.72,37.81
N$85  (via drill 0.8 pad 1.68)
  other vias: 48.72,35.26
N$86  (via drill 0.8 pad 1.68)
  other vias: 51.27,35.27
N$87  (via drill 0.8 pad 1.68)
  other vias: 51.27,37.81
N$88  (via drill 0.8 pad 1.68)
  other vias: 53.81,37.81
N$89  (via drill 0.8 pad 1.68)
  other vias: 56.33,37.81
N$90  (via drill 0.8 pad 1.68)
  other vias: 53.81,35.26
N$91  (via drill 0.8 pad 1.68)
  other vias: 56.34,35.27
N$92  (via drill 0.8 pad 1.68)
  other vias: 58.88,35.27
N$93  (via drill 0.8 pad 1.68)
  other vias: 61.42,35.27
N$94  (via drill 0.8 pad 1.68)
  other vias: 61.41,37.81
N$95  (via drill 0.8 pad 1.68)
  other vias: 63.96,37.81
N$96  (via drill 0.8 pad 1.68)
  other vias: 63.96,35.26
N$97  (via drill 0.8 pad 1.68)
  other vias: 66.51,35.26
N$98  (via drill 0.8 pad 1.68)
  other vias: 66.51,37.81
N$99  (via drill 0.8 pad 1.68)
  other vias: 69.03,37.81
N$100  (via drill 0.8 pad 1.68)
  other vias: 69.05,35.27
N$101  (via drill 0.8 pad 1.68)
  other vias: 71.57,35.27
N$102  (via drill 0.8 pad 1.68)
  other vias: 74.11,35.27
N$103  (via drill 0.8 pad 1.68)
  other vias: 71.59,37.81
N$104  (via drill 0.8 pad 1.68)
  other vias: 74.12,37.81
N$105  (via drill 0.8 pad 1.68)
  other vias: 76.65,37.81
N$106  (via drill 0.8 pad 1.68)
  other vias: 76.68,35.27
N$107  (via drill 0.8 pad 1.68)
  other vias: 79.21,35.27
N$108  (via drill 0.8 pad 1.68)
  other vias: 79.21,37.8
N$109  (via drill 0.8 pad 1.68)
  other vias: 81.76,37.81
N$110  (via drill 0.8 pad 1.68)
  other vias: 81.74,35.27
N$111  (via drill 0.8 pad 1.68)
  other vias: 84.29,35.27
N$112  (via drill 0.8 pad 1.68)
  other vias: 86.83,35.27
N$113  (via drill 0.8 pad 1.68)
  other vias: 86.83,37.81
N$114  (via drill 0.8 pad 1.68)
  other vias: 84.28,37.81
N$115  (via drill 0.8 pad 1.68)
  other vias: 89.37,37.82
N$116  (via drill 0.8 pad 1.68)
  other vias: 89.36,35.27
N$117  (via drill 0.8 pad 1.68)
  other vias: 91.91,35.27
N$118  (via drill 0.8 pad 1.68)
  other vias: 91.91,37.81
N$119  (via drill 0.8 pad 1.68)
  other vias: 94.44,37.8
N$120  (via drill 0.8 pad 1.68)
  other vias: 94.46,35.27
N$121  (via drill 0.8 pad 1.68)
  other vias: 96.97,35.28
N$122  (via drill 0.8 pad 1.68)
  other vias: 96.97,37.82
N$123  (via drill 0.8 pad 1.68)
  other vias: 58.89,37.81
N$124  (via drill 3.2)
  other vias: 144,21.06
N$125  (via drill 3.2 pad 1.68)
  other vias: 48.68,10.08
N$126  (via drill 3.2 pad 1.68)
  other vias: 62.35,66.08
N$127
  pour Bottom (isolate 1.016): 2.24,101.34 106.74,101.34 106.74,2.34 2.24,2.34
N$128
  pour Top (isolate 1.016): 2.24,101.34 106.74,101.34 106.74,2.34 2.24,2.34
N$129  (via drill 1 pad 1.93)
  other vias: 140.01,77.38
N$130  (via drill 1 pad 1.93)
  other vias: 140,74.85
N$131  (via drill 1 pad 1.93)
  other vias: 140,72.3
N$132  (via drill 1 pad 1.93)
  other vias: 137.48,72.3
N$133  (via drill 1 pad 1.93)
  other vias: 137.47,74.84
N$134  (via drill 1 pad 1.93)
  other vias: 137.48,77.39
N$135  (via drill 1 pad 1.93)
  other vias: 130,77.37
N$136  (via drill 1 pad 1.93)
  other vias: 130,74.83
N$137  (via drill 1 pad 1.93)
  other vias: 130.01,72.31
N$138
  Bottom 0.61: R1.S 117.51,31.63 U1.3
N$139  (via drill 1 pad 1.93)
  other vias: 127.46,72.3
N$140  (via drill 1 pad 1.93)
  other vias: 127.47,74.86
N$141  (via drill 1 pad 1.93)
  other vias: 127.46,77.37
N$142  (via drill 1 pad 1.93)
  other vias: 120,77.38
N$143  (via drill 1 pad 1.93)
  other vias: 120.01,74.84
N$144  (via drill 1 pad 1.93)
  other vias: 120.02,72.3
N$145  (via drill 1 pad 1.93)
  other vias: 117.47,72.3
N$146  (via drill 1 pad 1.93)
  other vias: 117.47,74.84
N$147  (via drill 1 pad 1.93)
  other vias: 117.47,77.38
N$148  (via drill 1 pad 1.93)
  other vias: 97.28,11.11
N$149  (via drill 1 pad 1.93)
  other vias: 97.28,8.56
N$150  (via drill 1 pad 1.93)
  other vias: 94.74,8.56
N$151  (via drill 1 pad 1.93)
  other vias: 92.2,8.58
N$152  (via drill 1 pad 1.93)
  other vias: 92.21,11.13
N$153  (via drill 1 pad 1.93)
  other vias: 94.73,11.1
N$154  (via drill 1 pad 1.93)
  other vias: 97.29,11.13
N$155  (via drill 1 pad 1.93)
  other vias: 97.13,19.57
N$156  (via drill 1 pad 1.93)
  other vias: 97.13,22.11
N$157  (via drill 1 pad 1.93)
  other vias: 94.58,22.11
N$158  (via drill 1 pad 1.93)
  other vias: 92.05,22.11
N$159  (via drill 1 pad 1.93)
  other vias: 89.5,22.12
N$160  (via drill 1 pad 1.93)
  other vias: 86.97,22.11
N$161  (via drill 1 pad 1.93)
  other vias: 84.43,22.11
N$162  (via drill 1 pad 1.93)
  other vias: 81.89,22.11
N$163  (via drill 1 pad 1.93)
  other vias: 79.35,22.11
N$164  (via drill 1 pad 1.93)
  other vias: 94.59,19.57
N$165  (via drill 1 pad 1.93)
  other vias: 92.05,19.57
N$166  (via drill 1 pad 1.93)
  other vias: 89.51,19.57
N$167  (via drill 1 pad 1.93)
  other vias: 86.96,19.57
N$168  (via drill 1 pad 1.93)
  other vias: 84.43,19.58
N$169  (via drill 1 pad 1.93)
  other vias: 81.88,19.57
N$170  (via drill 1 pad 1.93)
  other vias: 79.35,19.57
N$171  (via drill 1 pad 1.93)
  other vias: 82.78,8.58
N$172  (via drill 1 pad 1.93)
  other vias: 82.77,11.12
N$173  (via drill 1 pad 1.93)
  other vias: 80.24,11.11
N$174  (via drill 1 pad 1.93)
  other vias: 77.69,11.11
N$175  (via drill 1 pad 1.93)
  other vias: 77.69,8.57
N$176  (via drill 1 pad 1.93)
  other vias: 80.24,8.57
N$177  (via drill 1 pad 1.93)
  other vias: 67.78,11.11
N$178  (via drill 1 pad 1.93)
  other vias: 65.24,11.11
N$179  (via drill 1 pad 1.93)
  other vias: 62.7,11.11
N$180  (via drill 1 pad 1.93)
  other vias: 62.7,8.57
N$181  (via drill 1 pad 1.93)
  other vias: 65.25,8.58
N$182  (via drill 1 pad 1.93)
  other vias: 67.78,8.57
N$183  (via drill 1 pad 1.93)
  other vias: 67.79,22.11
N$184  (via drill 1 pad 1.93)
  other vias: 65.24,22.11
N$185  (via drill 1 pad 1.93)
  other vias: 62.7,22.11
N$186  (via drill 1 pad 1.93)
  other vias: 62.7,19.57
N$187  (via drill 1 pad 1.93)
  other vias: 65.24,19.57
N$188  (via drill 1 pad 1.93)
  other vias: 67.78,19.58
N$189  (via drill 1 pad 1.93)
  other vias: 123.28,22.11
N$190  (via drill 1 pad 1.93)
  other vias: 123.27,19.58
N$191  (via drill 1 pad 1.93)
  other vias: 120.74,19.57
N$192  (via drill 1 pad 1.93)
  other vias: 120.72,22.11
N$193  (via drill 1 pad 1.93)
  other vias: 118.21,22.12
N$194  (via drill 1 pad 1.93)
  other vias: 118.19,19.58
N$195  (via drill 1 pad 1.93)
  other vias: 129.47,52.73
N$196  (via drill 1 pad 1.93)
  other vias: 129.46,50.2
N$197  (via drill 1 pad 1.93)
  other vias: 129.49,47.63
N$198  (via drill 1 pad 1.93)
  other vias: 129.46,45.09
N$199  (via drill 1 pad 1.93)
  other vias: 129.46,42.56
N$200  (via drill 1 pad 1.93)
  other vias: 129.47,40.03
N$201  (via drill 1 pad 1.93)
  other vias: 129.47,37.5
N$202  (via drill 1 pad 1.93)
  other vias: 129.48,34.94
N$203  (via drill 1 pad 1.93)
  other vias: 132.01,34.94
N$204  (via drill 1 pad 1.93)
  other vias: 132,37.48
N$205  (via drill 1 pad 1.93)
  other vias: 132,40.01
N$206  (via drill 1 pad 1.93)
  other vias: 132.01,42.56
N$207  (via drill 1 pad 1.93)
  other vias: 132,45.1
N$208  (via drill 1 pad 1.93)
  other vias: 132.03,47.62
N$209  (via drill 1 pad 1.93)
  other vias: 132,50.16
N$210  (via drill 1 pad 1.93)
  other vias: 132.01,52.73
N$211  (via drill 1 pad 1.93)
  other vias: 26.25,20.35
N$212  (via drill 1 pad 1.93)
  other vias: 23.69,20.34
N$213  (via drill 1 pad 1.93)
  other vias: 21.17,20.34
N$214  (via drill 1 pad 1.93)
  other vias: 18.61,20.34
N$215  (via drill 1 pad 1.93)
  other vias: 16.08,20.35
N$216  (via drill 1 pad 1.93)
  other vias: 13.54,20.34
N$217
  pour Bottom (isolate 1.016): 108.74,11.84 108.74,101.84 170.74,101.84 170.74,11.84
N$218
  pour Top (isolate 1.016): 108.74,11.84 108.74,101.84 170.74,101.84 170.74,11.84
R/W  (via drill 0.8 pad 1.68)
  Top 0.406: v69.24,32.84 69.74,32.84 75.24,27.34 75.24,18.34 v75.74,17.84
  Bottom 0.406: v75.74,17.84 76.74,16.84 83.24,16.84 84.24,17.84 84.24,19.38 LCD-BOARD.5 | v69.24,32.84 69.07,33.01 U$1.P$27
R_S  (via drill 0.8 pad 1.68)
  Top 0.406: LCD.4 129.39,37.49 v126.74,34.84
  Bottom 0.406: v126.74,34.84 116.74,34.84 115.74,33.84 113.34,33.84 U1.4
R_W  (via drill 0.8 pad 1.68)
  Top 0.406: v115.74,36.84 115.74,40.84 120.74,45.84 120.74,59.84 121.74,60.84 134.74,60.84 135.74,61.84 137.74,61.84 139.74,59.84 139.74,44.84 134.74,39.84 132.2,39.84 LCD.5
  Bottom 0.406: v115.74,36.84 113.14,36.84 U1.5
RESET
  Bottom 0.406: U$1.P$84 76.69,90.39 75.74,91.34 27.74,91.34 22.74,86.34 22.74,39.34 30.24,31.84 32.74,31.84 34.24,30.34 57.01,30.34 START-RESET.4
RESET1  (via drill 0.8 pad 1.68)
  Top 0.61: START/RESET.4 120.74,17.84 121.74,16.84 127.74,16.84 132.74,21.84 132.74,26.84 v134.74,28.84
  Bottom 0.61: v134.74,28.84 151.47,28.84 RESET.1
  Bottom 0.813: RESET.1 155.58,39.84 | 155.58,39.84 RESET.2 | C4.2 155.58,39.84
RS  (via drill 0.8 pad 1.68)
  Top 0.406: v29.74,24.34 29.74,26.84 v30.74,27.84 | v66.74,32.84 56.74,32.84 55.74,31.84 v55.74,28.84
  Bottom 0.406: LCD-BOARD.4 81.89,27.69 79.24,30.34 74.74,30.34 73.74,31.34 68.24,31.34 v66.74,32.84 66.74,35.05 U$1.P$25 | FTDI.RXI 23.7,20.8 26.24,23.34 28.74,23.34 v29.74,24.34 | v30.74,27.84 54.74,27.84 v55.74,28.84
RX  (via drill 0.8 pad 1.68)
  Top 0.406: v38.24,24.34 40.74,24.34 v49.74,33.34
  Bottom 0.406: USART-TTL.2 37.47,23.57 v38.24,24.34 | v49.74,33.34 51.29,34.89 U$1.P$13
SENS1  (via drill 0.8 pad 1.68)
  Top 0.406: 116.74,74.84 SENSOR/ERROR1.3 114.74,74.84 113.74,75.84 113.74,90.84 114.74,91.84 v159.74,91.84
  Bottom 0.406: v159.74,91.84 SENS1.2
SENS2  (via drill 0.8 pad 1.68)
  Top 0.406: SENSOR/ERROR2.3 126.74,74.84 125.74,73.84 125.74,71.34 126.74,70.34 158.24,70.34 v159.74,71.84
  Bottom 0.406: v159.74,71.84 159.74,76.34 162.24,78.84 SENS2.2
SENS3  (via drill 0.8 pad 1.68)
  Top 0.406: SENSOR/ERROR3.3 134.74,74.84 v133.74,73.84 | v139.24,68.34 146.74,68.34 149.24,65.84 v159.74,65.84
  Bottom 0.406: v133.74,73.84 133.74,69.84 135.24,68.34 v139.24,68.34 | v159.74,65.84 SENS3.2
START  (via drill 0.8 pad 1.68)
  Top 0.406: v62.74,15.84 59.74,12.84 59.74,6.84 63.74,2.84 99.24,2.84 104.74,8.34 104.74,40.84 100.74,44.84 78.24,44.84 76.74,46.34 v76.74,82.84
  Bottom 0.406: START-RESET.3 65.24,18.34 v62.74,15.84 | v76.74,82.84 76.74,86.01 U$1.P$83
START1  (via drill 1 pad 1.93)
  Top 0.61: START/RESET.3 v120.74,24.84
  Bottom 0.61: v120.74,24.84 155.58,24.84
  Bottom 0.813: STARTSTOP.1 155.58,21.84 | 155.58,21.84 155.58,24.84 STARTSTOP.2 | C3.2 155.58,21.84
TX  (via drill 0.8 pad 1.68)
  Top 0.406: v39.24,40.34 34.24,40.34 33.74,39.84 33.74,25.84 31.74,23.84 v31.74,16.34
  Bottom 0.406: FTDI.TXO 21.16,17.42 22.24,16.34 v31.74,16.34 32.74,16.34 39.24,16.34 40.24,17.34 40.24,20.11 USART-TTL.3 | U$1.P$14 51.29,39.29 50.24,40.34 v39.24,40.34
VDD  (via drill 0.8 pad 1.68, 1 pad 1.93)
  Top 0.406: SENSOR/ERROR1.2 v120.01,86.11 | v124.74,85.84 129.24,85.84 130.24,84.84 130.24,77.61 SENSOR/ERROR2.2 | LCD.2 129.47,33.57 v127.74,31.84
  Top 0.61: START/RESET.2 126.47,19.57 127.74,20.84 v127.74,31.84 | v150.74,60.84 v144.74,60.84 144.74,32.84 v143.74,31.84 | SENSOR/ERROR3.2 v144.2,77.38
  Bottom 0.406: v124.74,85.84 120.28,85.84 v120.01,86.11
  Bottom 0.61: U1.2 115.49,29.09 116.74,27.84 120.74,27.84 121.74,28.84 121.74,30.34 R1.E 126.74,32.68 v127.74,31.84 v143.74,31.84 | SENS1.1 158.78,94.38 157.74,92.84 157.74,82.81 158.81,81.24 | 158.81,81.24 164.6,81.24 SENS2.1 | SENS3.1 158.78,68.38 | 158.81,81.24 157.74,79.67 157.74,69.92 158.78,68.38 | R3.2 151.82,59.82 | 151.82,59.82 152.28,60.28 157.19,60.28 157.74,60.84 157.74,66.84 158.78,68.38 | 151.82,59.82 151.76,59.82 v150.74,60.84 | v144.2,77.38 146.74,74.84 146.74,62.84 v144.74,60.84 141.74,60.84 133.74,67.84 127.24,67.84 124.74,70.34 v124.74,85.84
VSS  (via drill 0.8 pad 1.68, 1 pad 1.93)
  Top 0.406: v159.74,89.34 v155.74,89.34 | 123.03,26.55 117.45,26.55 v116.74,25.84
  Top 0.61: R1.A 123.03,26.55 123.03,22.36 START/RESET.1 | v130.5,27.6 131.74,28.84 131.74,34.68 LCD.1 | SENSOR/ERROR1.1 v117.47,87.95 | v127.52,83.78 127.52,77.43 SENSOR/ERROR2.1 | SENSOR/ERROR3.1 137.47,85.57 v137.74,85.84
  Bottom 0.406: SENS1.3 159.78,89.3 v159.74,89.34 | v155.74,89.34 155.24,89.34 154.24,90.34 151.24,90.34 150.74,89.84 150.74,88.59 LED2.K | v116.74,25.84 113.72,25.84 U1.1
  Bottom 0.61: R1.A v130.5,27.6 | RESET.4 160.56,48.02 159.74,48.84 152.74,48.84 | 152.74,48.84 151.74,49.84 151.74,53.43 LED1.K 150.05,53.53 148.74,54.84 148.74,67.84 | 148.74,67.84 148.74,77.84 | 148.74,77.84 148.74,86.59 148.87,86.72 | LED3.K 150.15,77.84 148.74,77.84 | LED4.K 150.31,67.84 148.74,67.84 | SENS3.3 167.2,63.3 167.74,63.84 167.74,75.31 166.89,76.16 164.88,76.16 SENS2.3 167.2,76.3 167.74,76.84 167.74,88.65 166.89,89.5 164.94,89.5 SENS1.3 | LCD.1 149.85,34.95 151.74,36.84 151.74,47.84 152.74,48.84 | 127.52,87.84 128.03,88.34 128.14,88.23 137.05,88.23 137.74,87.53 | v117.47,87.95 118,88.47 126.89,88.47 127.52,87.84 | 148.87,86.72 LED2.K | 127.52,87.84 v127.52,83.78 | 147.24,88.34 147.28,88.3 | 147.28,88.3 148.87,86.72 | v137.74,85.84 137.74,87.53 | 137.74,87.53 137.74,87.65 138.31,88.23 147.21,88.23 147.28,88.3
  Bottom 0.813: 160.56,21.84 STARTSTOP.4 RESET.3 160.56,39.84 | 160.56,21.84 STARTSTOP.3 | C3.1 160.56,21.84 | 160.56,39.84 RESET.4 | C4.1 160.56,39.84